# EAGLE schematic CanSplitter (EAGLE 9.6.2)
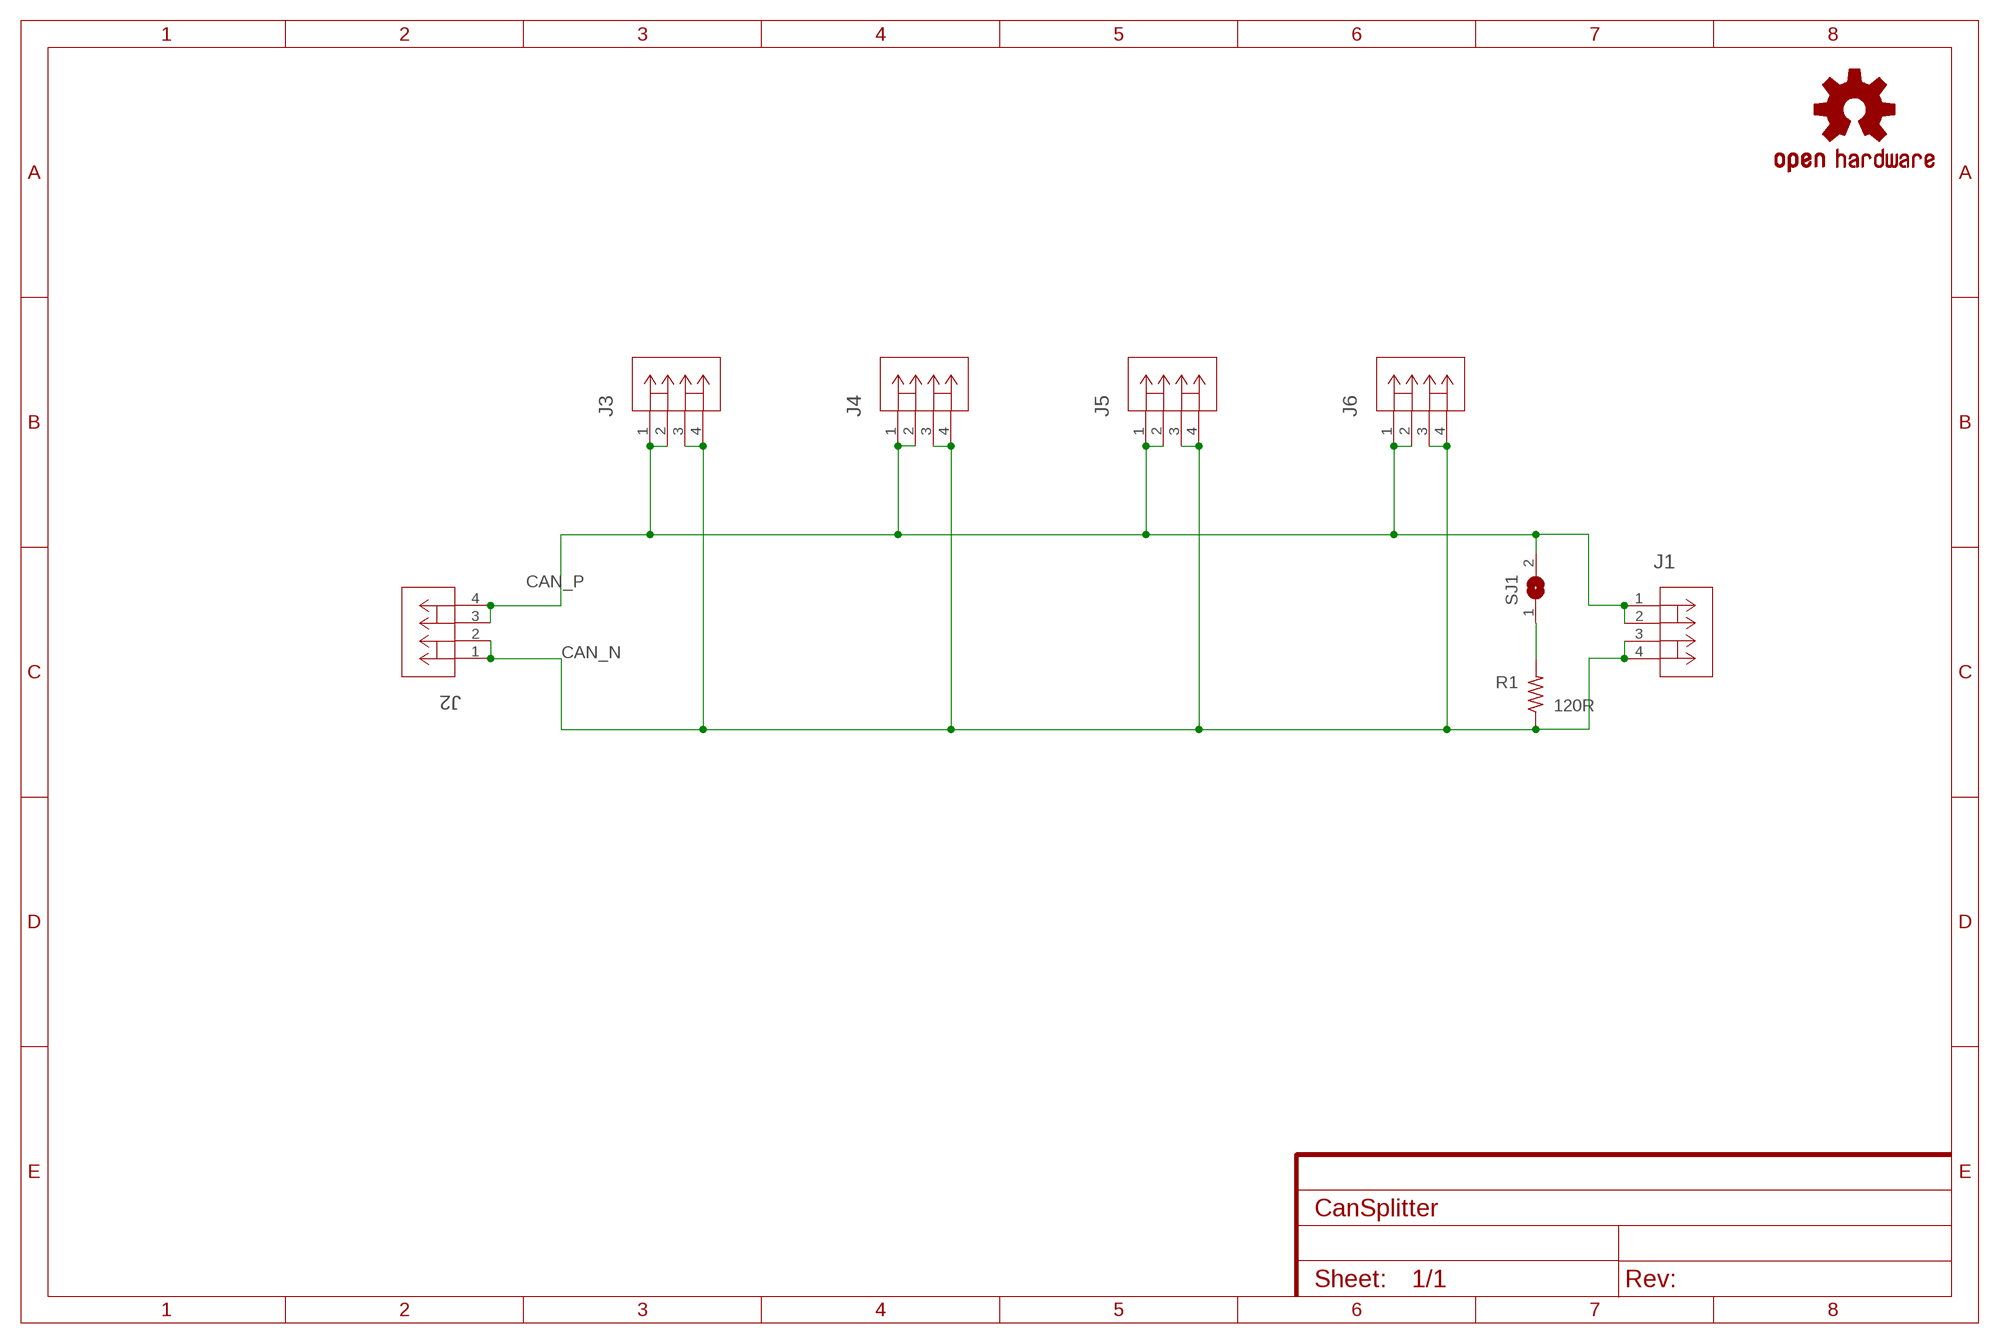
[diagram p0: schematic, sheet 1]

## Parts
J1  1885650000  [CONN4_1885650000_WED]
J2  1885650000  [CONN4_1885650000_WED]
J3  1885650000  [CONN4_1885650000_WED]
J4  1885650000  [CONN4_1885650000_WED]
J5  1885650000  [CONN4_1885650000_WED]
J6  1885650000  [CONN4_1885650000_WED]
LOGO1  OSHW-LOGOL  [OSHW-LOGO-L]
R1  120R  R-US_R0603  [R0603]
SJ1  SJ  [SJ]

## Nets
CAN_N: J1.3 J1.4 J2.1 J2.2 J3.3 J3.4 J4.3 J4.4 J5.3 J5.4 J6.3 J6.4 R1.1
CAN_P: J1.1 J1.2 J2.3 J2.4 J3.1 J3.2 J4.1 J4.2 J5.1 J5.2 J6.1 J6.2 SJ1.2
N$1: R1.2 SJ1.1

## Library data of the parts
J1-J6 = weidmüllerLSF:1885650000; COPYRIGHT: Copyright (C) 2025 Ultra Librarian. All rights reserved.; MANUFACTURER_PART_NUMBER: 1885650000; MFR_NAME: Weidmuller
LOGO1 = SparkFun-Aesthetics:OSHW-LOGO: Open-Source Hardware (OSHW) Logo This logo indicates the piece of hardware it is found on incorporates a OSHW license and/or adheres to the definition of open source hardware found here: http://freedomdefined.org/OSHW
R1 = rcl:R-US_: RESISTOR, American symbol; SPICEPREFIX: R
SJ1 = jumper:SJ: SMD solder JUMPER